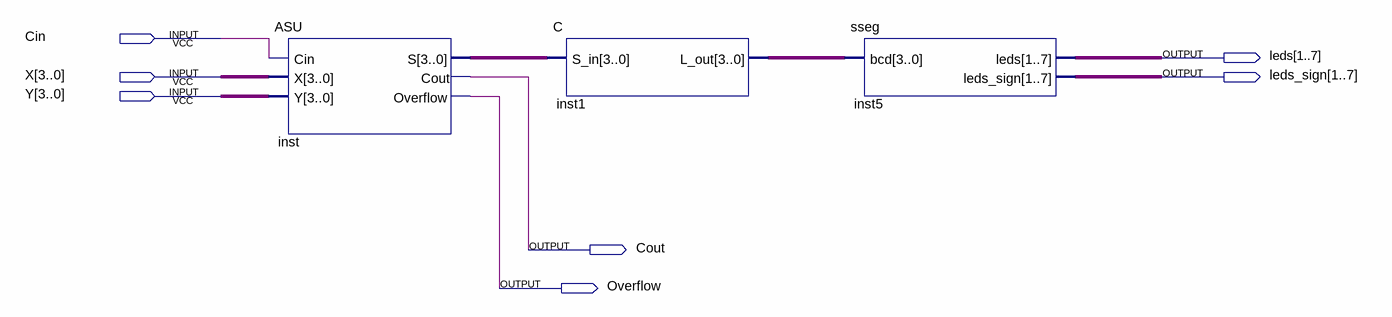
[diagram p0: schematic sheet]
// Quartus schematic CombinedASU2.bdf as structural Verilog: 3 symbols, 7 pins
module CombinedASU2 (
  input  Cin,
  input  [3:0] X,
  input  [3:0] Y,
  output [1:7] leds,
  output [1:7] leds_sign,
  output Cout,
  output Overflow
);

  wire [3:0] inst1_l_out, inst_s;

  ASU inst (.Cin(Cin), .X(X), .Y(Y), .S(inst_s), .Cout(Cout), .Overflow(Overflow));
  C inst1 (.S_in(inst_s), .L_out(inst1_l_out));
  sseg inst5 (.bcd(inst1_l_out), .leds(leds), .leds_sign(leds_sign));
endmodule
